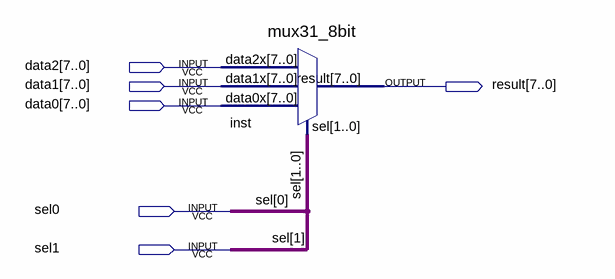
[diagram p0: schematic sheet]
// Quartus schematic test_mux.bdf as structural Verilog: 1 symbols, 6 pins
module test_mux (
  input  [7:0] data2,
  input  [7:0] data1,
  input  [7:0] data0,
  input  sel0,
  input  sel1,
  output [7:0] result
);

  mux31_8bit inst (.data2x(data2), .data1x(data1), .data0x(data0), .sel({sel1, sel0}), .result(result));
endmodule
